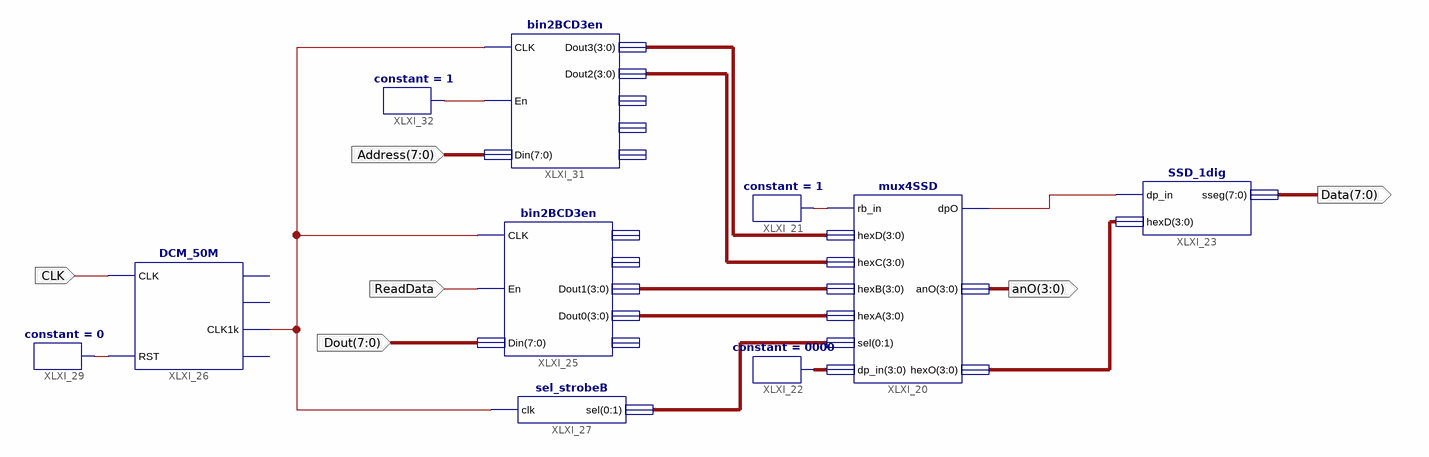
[diagram p0: schematic sheet 1]
// Xilinx ISE schematic ADDisplay.sch (spartan3e) as structural Verilog: 10 symbols, 6 ports
module ADDisplay (
  input  ReadData,
  input  CLK,
  input  [7:0] Dout,
  input  [7:0] Address,
  output [7:0] Data,
  output [3:0] anO
);

  wire XLXN_58, XLXN_62, XLXN_75, XLXN_77, XLXN_80;
  wire [1:0] XLXN_74;
  wire [3:0] XLXN_59, XLXN_65, XLXN_70, XLXN_71, XLXN_78, XLXN_79;

  mux4SSD XLXI_20 (
    .rb_in(XLXN_58), .hexD(XLXN_78), .hexC(XLXN_79), .hexB(XLXN_70), .hexA(XLXN_71),
    .sel({XLXN_74[0], XLXN_74[1]}), .dp_in(XLXN_59), .dpO(XLXN_62), .anO(anO), .hexO(XLXN_65));
  constant #(.CValue("1")) XLXI_21 (.O(XLXN_58));
  constant #(.CValue("0000")) XLXI_22 (.O(XLXN_59));
  bin2BCD3en XLXI_25 (
    .CLK(XLXN_75), .En(ReadData), .Din(Dout), .Dout1(XLXN_70), .Dout0(XLXN_71));  // open: Dout3, Dout2, RBout
  sel_strobeB XLXI_27 (.clk(XLXN_75), .sel({XLXN_74[0], XLXN_74[1]}));
  DCM_50M XLXI_26 (.CLK(CLK), .RST(XLXN_77), .CLK1k(XLXN_75));  // open: CLK1M, CLK10k, CLK1
  constant #(.CValue("0")) XLXI_29 (.O(XLXN_77));
  SSD_1dig XLXI_23 (.dp_in(XLXN_62), .hexD(XLXN_65), .sseg(Data));
  bin2BCD3en XLXI_31 (
    .CLK(XLXN_75), .En(XLXN_80), .Din(Address), .Dout3(XLXN_78), .Dout2(XLXN_79));  // open: Dout1, Dout0, RBout
  constant #(.CValue("1")) XLXI_32 (.O(XLXN_80));
endmodule
